# EAGLE design laser_sensor (EAGLE 9.1.3)
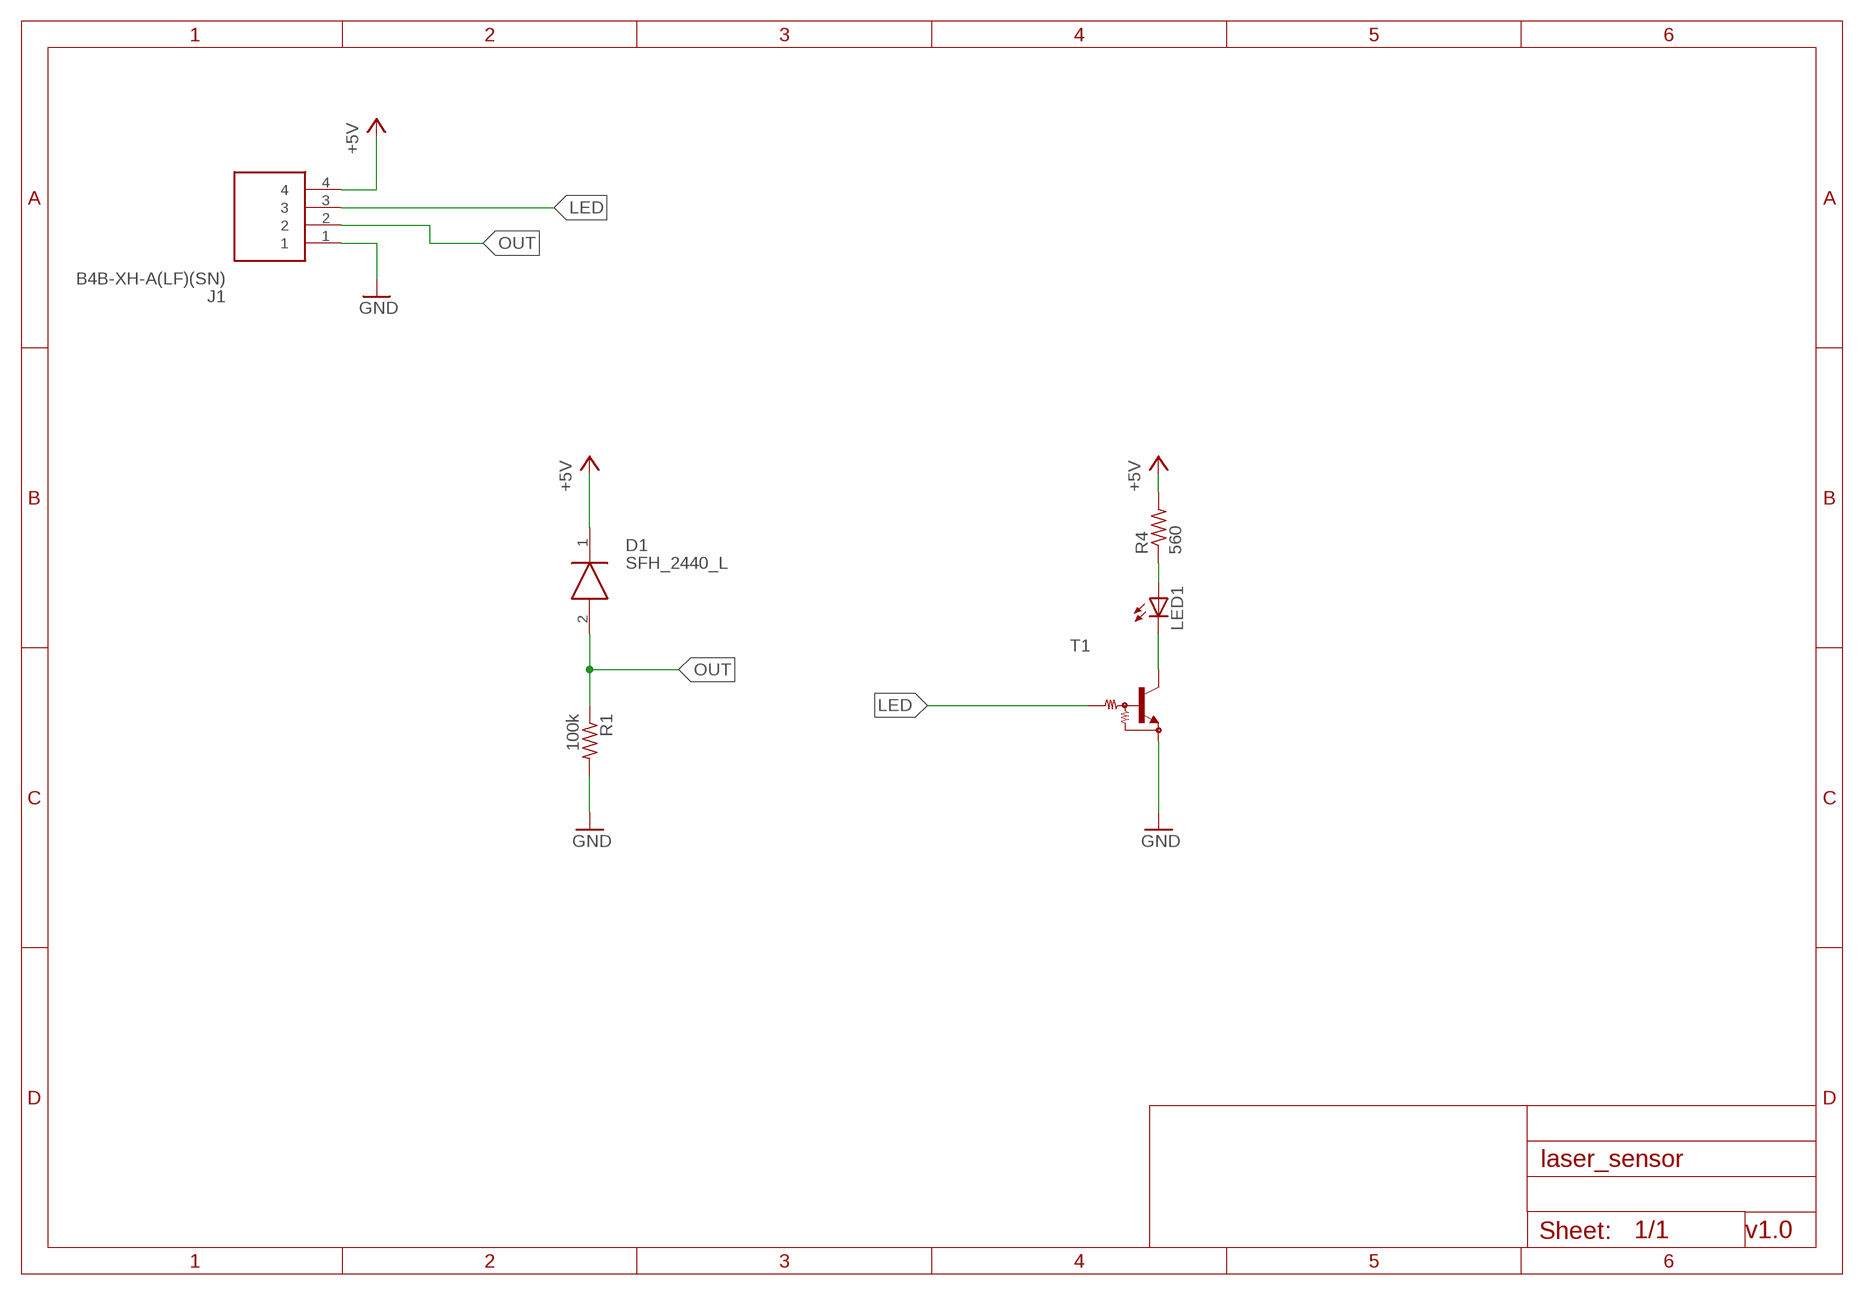
[diagram p0: schematic, sheet 1]

## Parts
D1  SFH_2440_L  [SFH2440L]
J1  B4B-XH-A(LF)(SN)  [SHDR4W64P0X250_1X4_1240X575X70]
LED1  LED3MM  [LED3MM]
R1  100k  R-US_R0603  [R0603]
R4  560  R-US_R0603  [R0603]
T1  MUN2214T1-NPN_DRIVER-SC59-BEC  [SC59-BEC]

## Nets
+5V: D1.1(ANODE) J1.4 R4.2
GND: J1.1 R1.2 T1.E
LED: J1.3 T1.B
N$1: LED1.A R4.1
N$2: LED1.K(C) T1.C
OUT: D1.2(CATHODE) J1.2 R1.1

## Notes on the sheet
- v1.0

## Library data of the parts
D1 = SFH_2440_L:SFH_2440_L: Silicon Photodiode, Human Eye Sensitive Source: Datasheet <http://www.osram-os.com/Graphics/XPic6/00231109_0.pdf/SFH 2440 L.pdf>; DESCRIPTION: Silicon Photodiode, Human Eye Sensitive; HEIGHT: mm; MANUFACTURER_NAME: OSRAM Opto Semiconductors; MANUFACTURER_PART_NUMBER: SFH 2440 L; MOUSER_PART_NUMBER: 720-SFH2440L; MOUSER_PRICE-STOCK: https://www.mouser.com/Search/Refine.aspx?Keyword=720-SFH2440L; RS_PART_NUMBER: 1243361P; RS_PRICE-STOCK: http://uk.rs-online.com/web/p/products/1243361P
J1 = B4B-XH-A(LF)(SN):B4B-XH-A(LF)(SN): XH-2.5mm Header top entry 4 way JST XH Series, Series Number B4B, 2.5mm Pitch 4 Way 1 Row Straight PCB Header, Solder Termination, 3A Source: Datasheet <http://uk.rs-online.com/web/p/products/8201551>; ARROW_PART_NUMBER: B4B-XH-A(LF)(SN); ARROW_PRICE/STOCK: https://www.arrow.com/en/products/b4b-xh-a-lf-sn/jst-manufacturing; DESCRIPTION: XH-2.5mm Header top entry 4 way JST XH Series, Series Number B4B, 2.5mm Pitch 4 Way 1 Row Straight PCB Header, Solder Termination, 3A; HEIGHT: 7mm; MANUFACTURER_NAME: JST (JAPAN SOLDERLESS TERMINALS); MANUFACTURER_PART_NUMBER: B4B-XH-A(LF)(SN); RS_PART_NUMBER: 1724913; RS_PRICE/STOCK: http://uk.rs-online.com/web/p/products/1724913
LED1 = led:LED: LED OSRAM: - CHIPLED LG R971, LG N971, LY N971, LG Q971, LY Q971, LO R971, LY R971 LH N974, LH R974 LS Q976, LO Q976, LY Q976 LO Q996 - Hyper CHIPLED LW Q18S LB Q993, LB Q99A, LB R99A - SideLED LS A670, LO A670, LY A670, LG A670, LP A670 LB A673, LV A673, LT A673, LW A673 LH A674 LY A675 LS A676, LA A676, LO A676, LY A676, LW A676 LS A679, LY A679, LG A679 - Hyper Micro SIDELED® LS Y876, LA Y876, LO Y876, LY Y876 LT Y87S - SmartLED LW L88C, LW L88S LB L89C, LB L89S, LG L890 LS L89K, LO L89K, LY L89K LS L896, LA L896, LO L896, LY L896 - TOPLED LS T670, LO T670, LY T670, LG T670, LP T670 LSG T670, LSP T670, LSY T670, LOP T670, LYG T670 LG T671, LOG T671, LSG T671 LB T673, LV T673, LT T673, LW T673 LH T674 LS T676, LA T676, LO T676, LY T676, LB T676, LH T676, LSB T676, LW T676 LB T67C, LV T67C, LT T67C, LS T67K, LO T67K, LY T67K, LW E67C LS E67B, LA E67B, LO E67B, LY E67B, LB E67C, LV E67C, LT E67C LW T67C LS T679, LY T679, LG T679 LS T770, LO T770, LY T770, LG T770, LP T770 LB T773, LV T773, LT T773, LW T773 LH T774 LS E675, LA E675, LY E675, LS T675 LS T776, LA T776, LO T776, LY T776, LB T776 LHGB T686 LT T68C, LB T68C - Hyper Mini TOPLED® LB M676 - Mini TOPLED Santana® LG M470 LS M47K, LO M47K, LY M47K Source: http://www.osram.convergy.de LUXEON: - LUMILED® LXK2-PW12-R00, LXK2-PW12-S00, LXK2-PW14-U00, LXK2-PW14-V00 LXK2-PM12-R00, LXK2-PM12-S00, LXK2-PM14-U00 LXK2-PE12-Q00, LXK2-PE12-R00, LXK2-PE12-S00, LXK2-PE14-T00, LXK2-PE14-U00 LXK2-PB12-K00, LXK2-PB12-L00, LXK2-PB12-M00, LXK2-PB14-N00, LXK2-PB14-P00, LXK2-PB14-Q00 LXK2-PR12-L00, LXK2-PR12-M00, LXK2-PR14-Q00, LXK2-PR14-R00 LXK2-PD12-Q00, LXK2-PD12-R00, LXK2-PD12-S00 LXK2-PH12-R00, LXK2-PH12-S00 LXK2-PL12-P00, LXK2-PL12-Q00, LXK2-PL12-R00 Source: www.luxeon.com KINGBRIGHT: KA-3528ASYC Source: www.kingbright.com
R1 R4 = rcl:R-US_: RESISTOR, American symbol; SPICEPREFIX: R
T1 = transistor:*-NPN_DRIVER-: NPN Bias Resistor Transistor

## Board
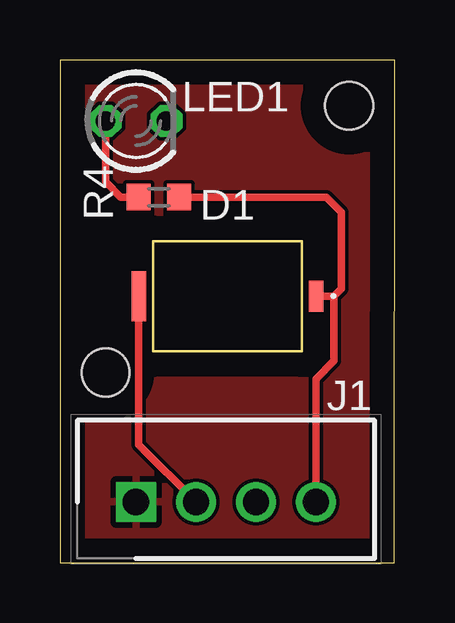
[diagram p1: board, top side]
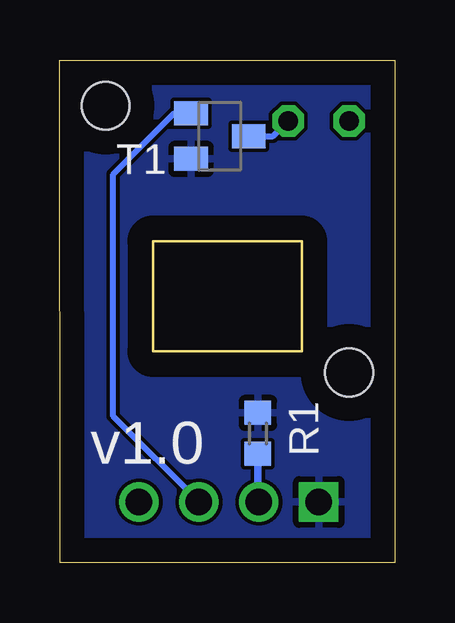
[diagram p2: board, bottom side, seen from below]

Size 13.97 x 20.95 mm. Coordinates in mm from the lower left corner, seen from the top.
Outline: 0,0 13.95,0 13.97,20.95 0,20.95 0,0
Copper layers (1*16): Top 0.035mm / dielectric 1.5mm / Bottom 0.035mm
Design rules "default": minimum track width 6mil, minimum drill 0.35mm, track to track 6mil, track to pad 6mil, pad to pad 6mil, via to via 6mil, smd to smd 6mil, copper to edge 40mil, drill to drill 6mil, minimum pad ring 10mil, minimum via ring 8mil, stop-mask expansion 4mil, vias tented up to drill 0mil, thermal gap 10mil
Holes 2 mm at 1.91,7.94 12.06,19.05

### Footprints (pad centres in the part's own frame; a part is rotated, then mirrored left to right if it is on the bottom)
SFH2440L = smd 0.6 x 1.3: 1 -3.7,0 | smd 0.6 x 2.1: 2 3.7,0
SHDR4W64P0X250_1X4_1240X575X70 = drill 1.1 pad 1.65 square: 1 0,0 | drill 1.1 pad 1.65: 2 2.5,0; 3 5,0; 4 7.5,0
LED3MM = drill 0.813 octagon: A -1.27,0; K 1.27,0
R0603 = smd 1 x 1.1: 1 -0.85,0; 2 0.85,0
SC59-BEC = smd 1 x 1.4: B -0.95,-1.2; C 0,1.2; E 0.95,-1.2

### Placement (x,y rotation side)
D1  6.99,11.11 180 top
J1  3.17,2.54 0 top
LED1  3.17,18.41 0 top
R1  5.71,5.4 90 bottom
R4  4.13,15.24 0 top
T1  7.3,17.78 270 bottom

### Tracks (layer width: path | path; a pad name or v marks a point on that pad's centre or on a via)
+5V
  Top 0.305: R4.2 11.11,15.24 11.75,14.61 11.75,11.43 11.43,11.11 | J1.4 10.68,7.66 11.43,8.41 11.43,11.11 | D1.1 11.43,11.11
GND
  pour Top: 13.97,20.95 0,20.95 0,0 13.97,0
  pour Bottom: 13.97,20.95 0,20.95 0,0 13.97,0
LED
  Bottom 0.254: J1.3 11.75,6.11 11.75,16.19 9.21,18.73 T1.B
N$1
  Top 0.305: R4.1 2.54,15.24 1.91,15.88 LED1.A
N$2
  Bottom 0.254: T1.C 5.08,17.78 LED1.K
OUT
  Top 0.305: D1.2 3.29,4.93 J1.2
  Bottom 0.305: J1.2 5.71,2.58 R1.1

### Text on the board
bNames: v1.0